# Altium schematic sheet 03_power.SchDoc: KART : POWER
size A4; DrawnBy: JNieto; DocumentNumber: 4; Revision: 1.0; SheetNumber: 4; SheetTotal: 10; Version: V 1.0.0
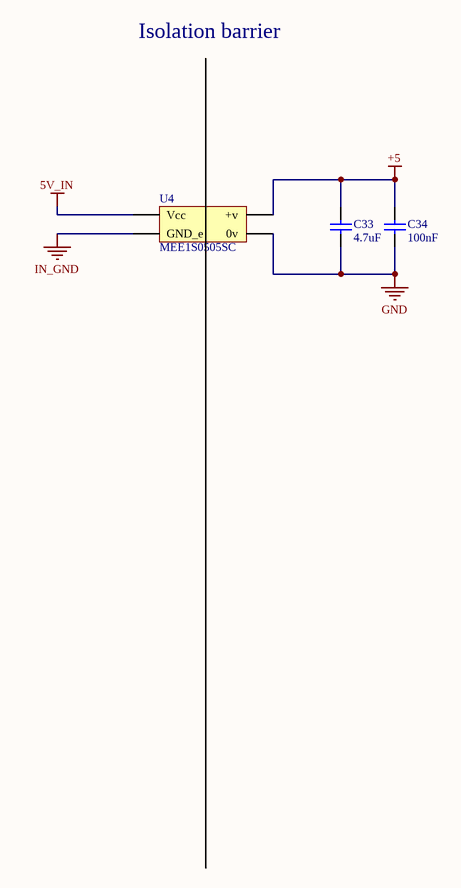
[diagram p0: 03_power.SchDoc]

## Parts
C33  value 4.7uF  [C0402]
C34  value 100nF  [C0603]  (hidden comment: Capacitor)
U4  MEE1S0505SC  [DCDC]

## Nets
5V_IN: U4.2(Vcc)
+5: C33.2 C34.2 U4.4(+v)
GND: C33.1 C34.1 U4.3(0v)
IN_GND: U4.1(GND_e)

## Notes on the sheet
- Isolation barrier

## Library data of the parts
C33 = MCD-01356: Capacitor, MLCC, 4.7uF, 6V3, X5R, 20%, 0402, T=0,5mm; Manufacturer_Part_Number: GRM155R60J475ME47; Manufacturer: MURATA; ECCN_US: EAR99; ECCN_EU: NEC; Provided_By: Subcon; Initial_Board_Reference: MB1372; Internal_Part_Number: MCD-01356; Status: Checked; Part_Type: Capacitor; Package: C0402; ComponentLink1Description: Datasheet; ComponentLink1URL: http://tunmcdsvn.tun.st.com/Component_Datasheet_Library/Trunk/Capacitors/Murata_Capacitor_GR_series
C34 = MCD-00102: Capacitor, MLCC, 100nF, 16V, X7R, 10%, 0402, T=0,5mm; Manufacturer_Part_Number: CC0402KRX7R7BB104; Manufacturer: YAGEO; Alternate_Manufacturer_Part_Number: GCM155R71C104KA55D; Alternate_Manufacturer: MURATA; Provided_By: SUBCO; Internal_Part_Number: MCD-00102; Status: Released; Part_Type: Capacitor; Package: C0402; ComponentLink1Description: Datasheet; ComponentLink1URL: http://tunmcdsvn.tun.st.com/Component_Datasheet_Library/Trunk/Capacitors/Yageo_Multilayer_Capacitor_X7R_series_100pF_to_22uF
U4 = DCDC